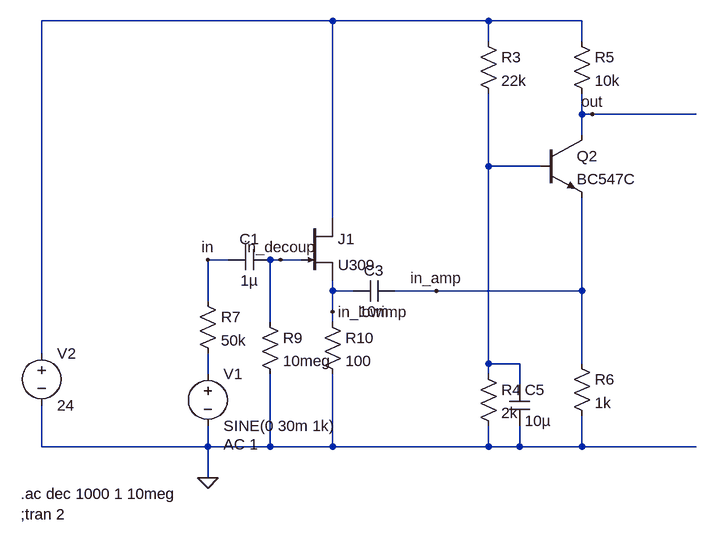
[diagram p0: schematic amp_labor2_2trans.asc]
amp_labor2_2trans.asc, the LTspice schematic file:
Version 4
SHEET 1 880 936
WIRE -144 160 -496 160
WIRE -48 160 -144 160
WIRE 192 160 -48 160
WIRE 336 160 192 160
WIRE 192 192 192 160
WIRE 336 192 336 160
WIRE 336 304 336 272
WIRE 352 304 336 304
WIRE 432 304 352 304
WIRE 512 304 432 304
WIRE 336 336 336 304
WIRE 192 384 192 272
WIRE 240 384 192 384
WIRE 272 384 240 384
WIRE -48 464 -48 160
WIRE 336 512 336 432
WIRE -208 528 -240 528
WIRE -128 528 -144 528
WIRE -96 528 -128 528
WIRE -48 576 -48 560
WIRE -16 576 -48 576
WIRE 112 576 48 576
WIRE 336 576 336 512
WIRE 336 576 112 576
WIRE -240 592 -240 528
WIRE -48 608 -48 576
WIRE -144 624 -144 528
WIRE -48 624 -48 608
WIRE -496 672 -496 160
WIRE 336 672 336 576
WIRE 192 688 192 384
WIRE 240 688 192 688
WIRE 336 688 336 672
WIRE -240 704 -240 672
WIRE 192 704 192 688
WIRE 240 720 240 688
WIRE -496 816 -496 752
WIRE -240 816 -240 784
WIRE -240 816 -496 816
WIRE -144 816 -144 704
WIRE -144 816 -240 816
WIRE -48 816 -48 704
WIRE -48 816 -144 816
WIRE 192 816 192 784
WIRE 192 816 -48 816
WIRE 240 816 240 784
WIRE 240 816 192 816
WIRE 336 816 336 768
WIRE 336 816 240 816
WIRE 512 816 336 816
WIRE -240 864 -240 816
FLAG -240 864 0
FLAG 352 304 out
FLAG -240 528 in
FLAG -128 528 in_decoup
FLAG -48 608 in_lowimp
FLAG 112 576 in_amp
DATAFLAG 432 304 ""
DATAFLAG 336 672 ""
DATAFLAG 240 384 ""
DATAFLAG 336 512 ""
DATAFLAG -144 160 ""
SYMBOL npn 272 336 R0
SYMATTR InstName Q2
SYMATTR Value BC547C
SYMBOL res 176 176 R0
SYMATTR InstName R3
SYMATTR Value 22k
SYMBOL res 176 688 R0
SYMATTR InstName R4
SYMATTR Value 2k
SYMBOL res 320 176 R0
SYMATTR InstName R5
SYMATTR Value 10k
SYMBOL res 320 672 R0
SYMATTR InstName R6
SYMATTR Value 1k
SYMBOL cap -144 512 R90
WINDOW 0 0 32 VBottom 2
WINDOW 3 32 32 VTop 2
SYMATTR InstName C1
SYMATTR Value 1µ
SYMBOL voltage -240 688 R0
WINDOW 123 24 124 Left 2
WINDOW 39 0 0 Left 2
SYMATTR Value2 AC 1
SYMATTR InstName V1
SYMATTR Value SINE(0 30m 1k)
SYMBOL voltage -496 656 R0
WINDOW 123 0 0 Left 2
WINDOW 39 0 0 Left 2
SYMATTR InstName V2
SYMATTR Value 24
SYMBOL res -256 576 R0
SYMATTR InstName R7
SYMATTR Value 50k
SYMBOL njf -96 464 R0
SYMATTR InstName J1
SYMATTR Value U309
SYMBOL res -160 608 R0
SYMATTR InstName R9
SYMATTR Value 10meg
SYMBOL res -64 608 R0
SYMATTR InstName R10
SYMATTR Value 100
SYMBOL cap 48 560 R90
WINDOW 0 0 32 VBottom 2
WINDOW 3 32 32 VTop 2
SYMATTR InstName C3
SYMATTR Value 10m
SYMBOL cap 224 720 R0
SYMATTR InstName C5
SYMATTR Value 10µ
TEXT -528 888 Left 2 !.ac dec 1000 1 10meg
TEXT -528 920 Left 2 !;tran 2

The netlist it stands for:
* amp_labor2_2trans.asc
Q2 out N002 in_amp 0 BC547C
R3 N001 N002 22k
R4 N002 0 2k
R5 N001 out 10k
R6 in_amp 0 1k
C1 in_decoup in 1µ
V1 N003 0 SINE(0 30m 1k) AC 1
V2 N001 0 24
R7 in N003 50k
J1 N001 in_decoup in_lowimp U309
R9 in_decoup 0 10meg
R10 in_lowimp 0 100
C3 in_amp in_lowimp 10m
C5 N002 0 10µ
.model NPN NPN
.model PNP PNP
.lib standard.bjt
.model NJF NJF
.model PJF PJF
.lib standard.jft
.ac dec 1000 1 10meg
;tran 2
.backanno
.end